# Altium schematic sheet Main.SchDoc
size C; Revision: A0
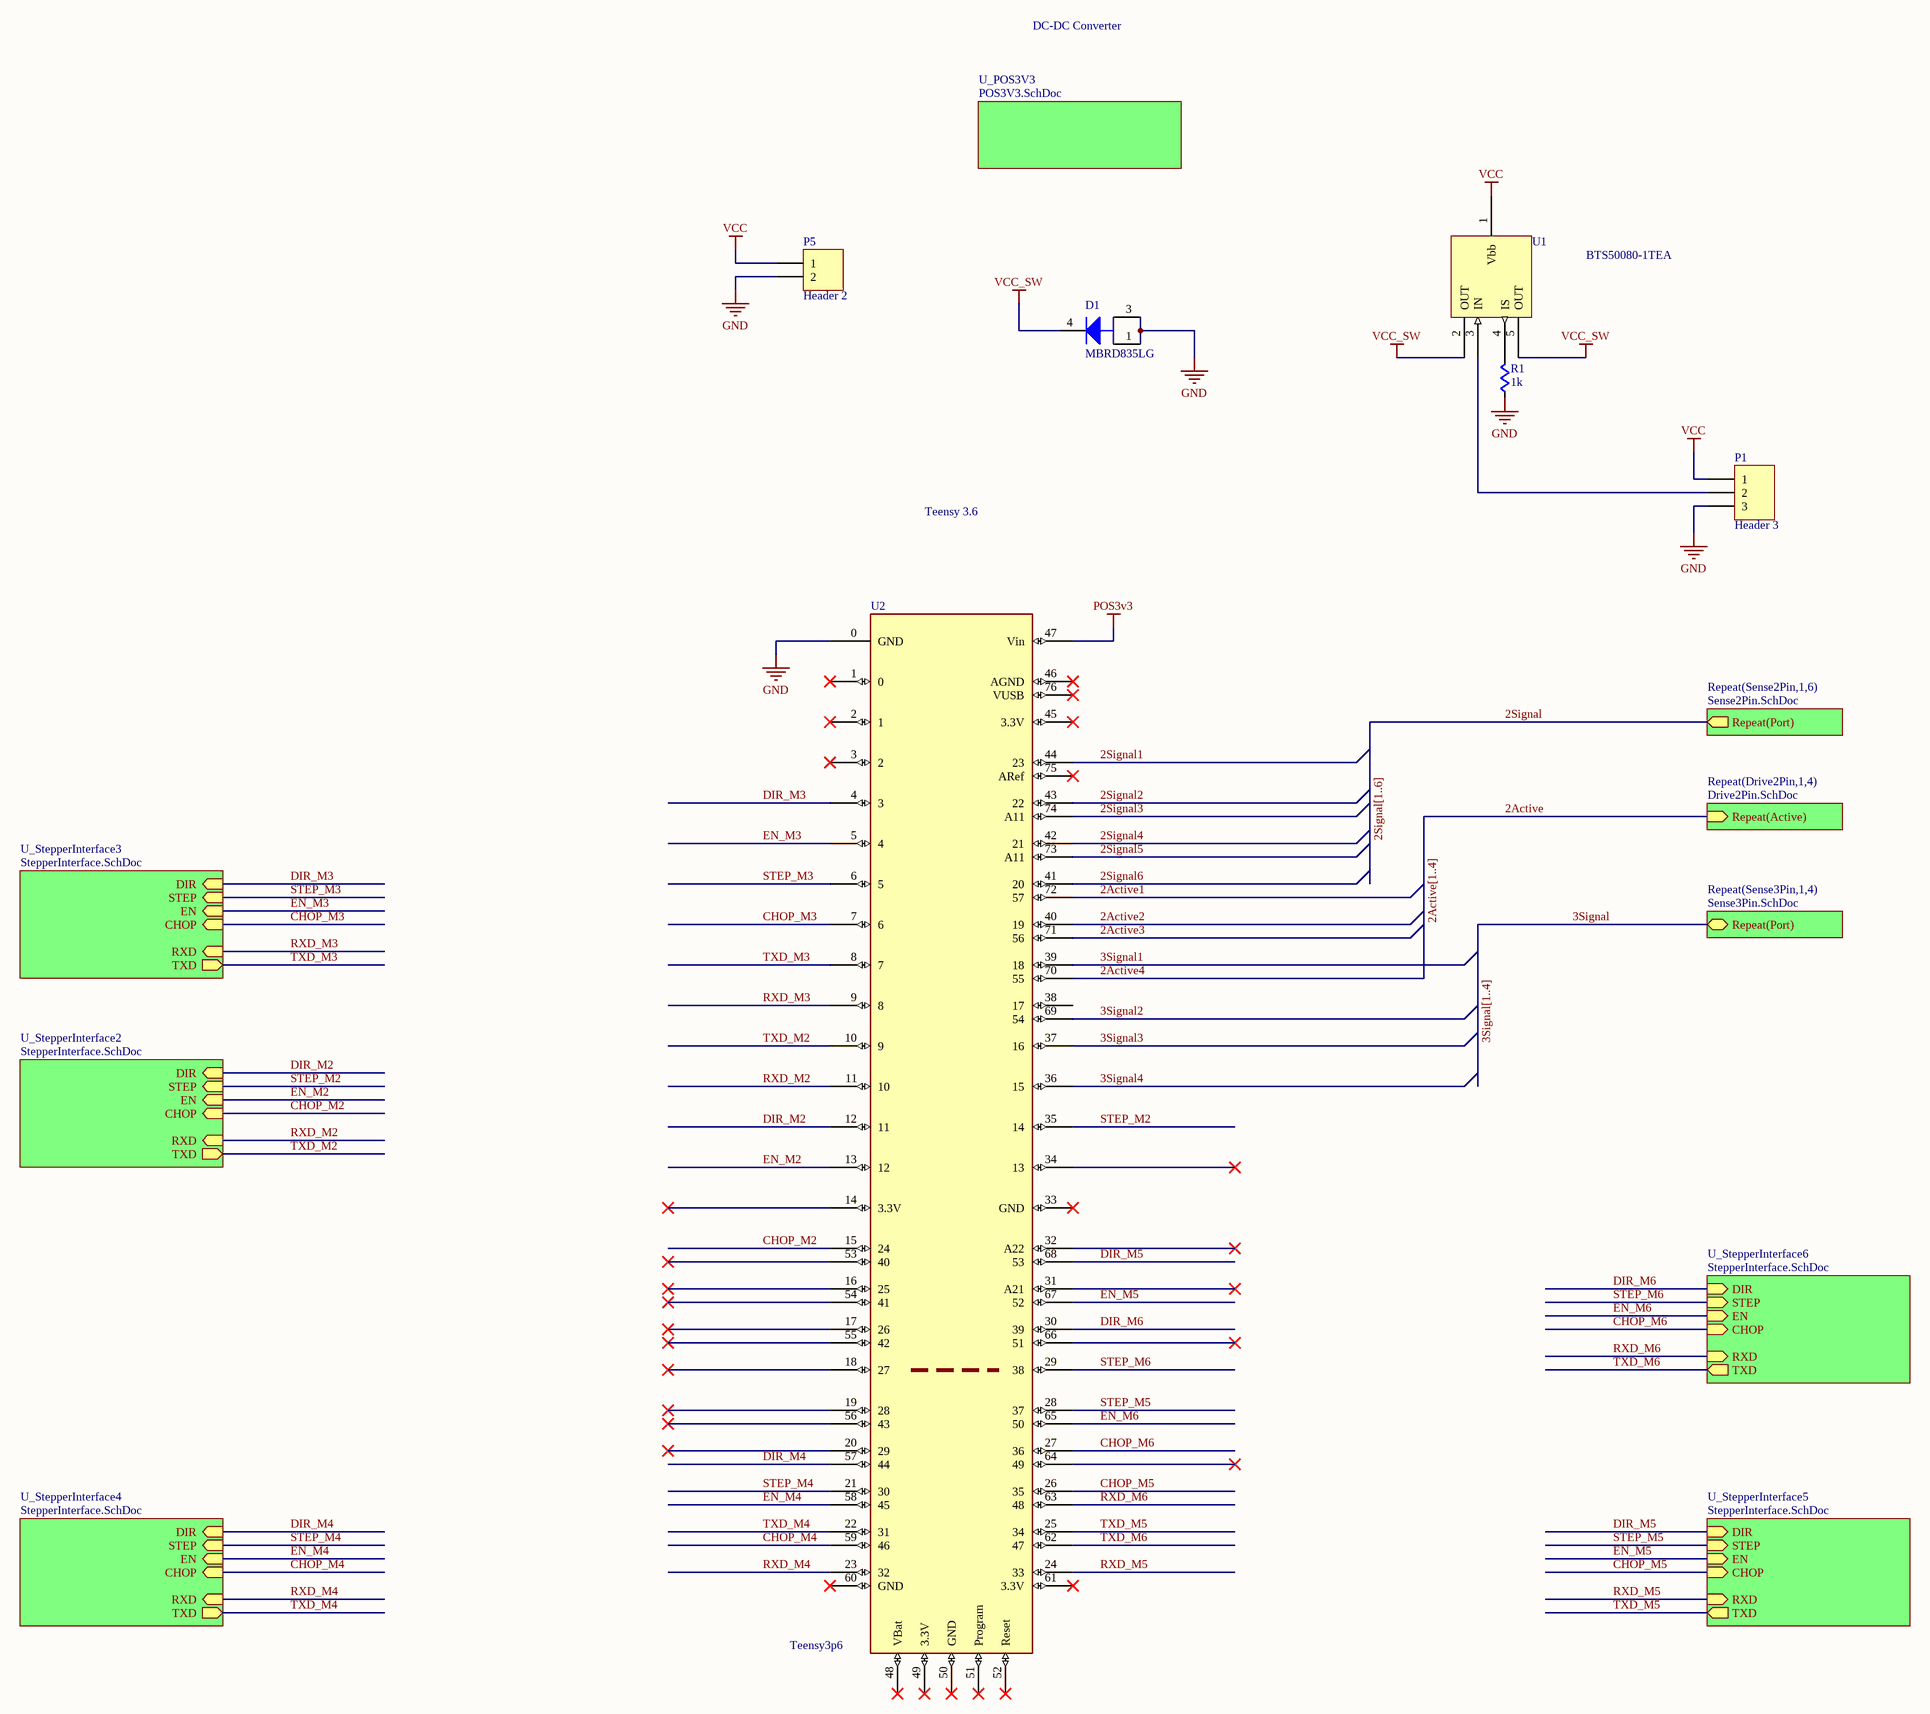
[diagram p0: Main.SchDoc]

## Parts
D1  MBRD835LG  [ONSC-DPAK-3-369C-01_V]
P1  Header 3  [HDR1X3]
P5  Header 2  [HDR1X2]
R1  value 1k  [R0805]  (hidden comment: Res)
U1  BTS50080-1TEA  [BTS50080]
U2  Teensy3p6  [Teensy3p6_full]

## Sub-sheets
Repeat(Drive2Pin,1,4) = Drive2Pin.SchDoc: Repeat(Active) (in)
Repeat(Sense2Pin,1,6) = Sense2Pin.SchDoc: Repeat(Port) (out)
Repeat(Sense3Pin,1,4) = Sense3Pin.SchDoc: Repeat(Port) (bidir)
U_POS3V3 = POS3V3.SchDoc: no entries
U_StepperInterface2 = StepperInterface.SchDoc: DIR (in), STEP (in), EN (in), CHOP (in), RXD (in), TXD (out)
U_StepperInterface3 = StepperInterface.SchDoc: DIR (in), STEP (in), EN (in), CHOP (in), RXD (in), TXD (out)
U_StepperInterface4 = StepperInterface.SchDoc: DIR (in), STEP (in), EN (in), CHOP (in), RXD (in), TXD (out)
U_StepperInterface5 = StepperInterface.SchDoc: DIR (in), STEP (in), EN (in), CHOP (in), RXD (in), TXD (out)
U_StepperInterface6 = StepperInterface.SchDoc: DIR (in), STEP (in), EN (in), CHOP (in), RXD (in), TXD (out)

## Nets
GND: D1.1(A) D1.3(A) P1.3 P5.2 R1.1 U2.0(GND)
POS3v3: U2.47(Vin)
VCC: P1.1 P5.1 U1.1(Vbb)
VCC_SW: D1.4(K) U1.2(OUT) U1.5(OUT)
2Active: sheet Repeat(Drive2Pin,1,4)/Repeat(Active)
2Active1: U2.72(57)
2Active2: U2.40(19)
2Active3: U2.71(56)
2Active4: U2.70(55)
2Signal: sheet Repeat(Sense2Pin,1,6)/Repeat(Port)
2Signal1: U2.44(23)
2Signal2: U2.43(22)
2Signal3: U2.74(A11)
2Signal4: U2.42(21)
2Signal5: U2.73(A11)
2Signal6: U2.41(20)
3Signal: sheet Repeat(Sense3Pin,1,4)/Repeat(Port)
3Signal1: U2.39(18)
3Signal2: U2.69(54)
3Signal3: U2.37(16)
3Signal4: U2.36(15)
CHOP_M2: U2.15(24) ; sheet U_StepperInterface2/CHOP
CHOP_M3: U2.7(6) ; sheet U_StepperInterface3/CHOP
CHOP_M4: U2.59(46) ; sheet U_StepperInterface4/CHOP
CHOP_M5: U2.26(35) ; sheet U_StepperInterface5/CHOP
CHOP_M6: U2.27(36) ; sheet U_StepperInterface6/CHOP
DIR_M2: U2.12(11) ; sheet U_StepperInterface2/DIR
DIR_M3: U2.4(3) ; sheet U_StepperInterface3/DIR
DIR_M4: U2.57(44) ; sheet U_StepperInterface4/DIR
DIR_M5: U2.68(53) ; sheet U_StepperInterface5/DIR
DIR_M6: U2.30(39) ; sheet U_StepperInterface6/DIR
EN_M2: U2.13(12) ; sheet U_StepperInterface2/EN
EN_M3: U2.5(4) ; sheet U_StepperInterface3/EN
EN_M4: U2.58(45) ; sheet U_StepperInterface4/EN
EN_M5: U2.67(52) ; sheet U_StepperInterface5/EN
EN_M6: U2.65(50) ; sheet U_StepperInterface6/EN
RXD_M2: U2.11(10) ; sheet U_StepperInterface2/RXD
RXD_M3: U2.9(8) ; sheet U_StepperInterface3/RXD
RXD_M4: U2.23(32) ; sheet U_StepperInterface4/RXD
RXD_M5: U2.24(33) ; sheet U_StepperInterface5/RXD
RXD_M6: U2.63(48) ; sheet U_StepperInterface6/RXD
STEP_M2: U2.35(14) ; sheet U_StepperInterface2/STEP
STEP_M3: U2.6(5) ; sheet U_StepperInterface3/STEP
STEP_M4: U2.21(30) ; sheet U_StepperInterface4/STEP
STEP_M5: U2.28(37) ; sheet U_StepperInterface5/STEP
STEP_M6: U2.29(38) ; sheet U_StepperInterface6/STEP
TXD_M2: U2.10(9) ; sheet U_StepperInterface2/TXD
TXD_M3: U2.8(7) ; sheet U_StepperInterface3/TXD
TXD_M4: U2.22(31) ; sheet U_StepperInterface4/TXD
TXD_M5: U2.25(34) ; sheet U_StepperInterface5/TXD
TXD_M6: U2.62(47) ; sheet U_StepperInterface6/TXD
NetP1_2: P1.2 U1.3(IN)
NetR1_2: R1.2 U1.4(IS)

Not connected (* = marked no-connect by the designer): U2 1(0)* 2(1)* 3(2)* 14(3.3V)* 16(25)* 17(26)* 18(27)* 19(28)* 20(29)* 31(A21)* 32(A22)* 33(GND)* 34(13)* 38(17) 45(3.3V)* 46(AGND)* 48(VBat)* 49(3.3V)* 50(GND)* 51(Program)* 52(Reset)* 53(40)* 54(41)* 55(42)* 56(43)* 60(GND)* 61(3.3V)* 64(49)* 66(51)* 75(ARef)* 76(VUSB)*

## Buses and harness runs
bus 2Active[1..4]
bus 2Signal[1..6]
bus 3Signal[1..4]

## Notes on the sheet
- DC-DC Converter
- Teensy 3.6

## Library data of the parts
D1 = CMP-1055-00169-1: SWITCHMODE(TM) Power Rectifier, 3-Pin DPAK, Pb-Free, Tube; Manufacturer: On Semiconductor; IFSM Max (A): 75; Configuration: Single; RoHS: TRUE; ComponentLink1Description: Manufacturer URL; PackageDescription: 3-Pin Flange Mount, Body 6.54 x 6.095 mm, Pitch 2.29 mm; Packing: Tube; ComponentLink2URL: http://www.onsemi.cn/pub_link/Collateral/MBRD835L-D.PDF; DatasheetVersion: Rev. 11; PackageVersion: Rev. E, 02/2014; ComponentLink3URL: http://www.onsemi.cn/pub_link/Collateral/369C.PDF; ComponentLink1URL: http://www.onsemi.com/; PackageReference: DPAK-3-369C-01; ComponentLink2Description: Datasheet; Mounting Technology: Surface Mount; ComponentLink3Description: Package Specification; PartNumber: MBRD835LG
P1 = Header 3: Header, 3-Pin; LatestRevisionDate: 17-Jul-2002; LatestRevisionNote: Re-released for DXP Platform.; Publisher: Altium Limited
P5 = Header 2: Header, 2-Pin; LatestRevisionDate: 17-Jul-2002; LatestRevisionNote: Re-released for DXP Platform.; Publisher: Altium Limited
R1 = Res: resistor
U1 = BTS50080-1TEA: Smart High-Side Power Switch